# Altium schematic sheet power.SchDoc
size A4
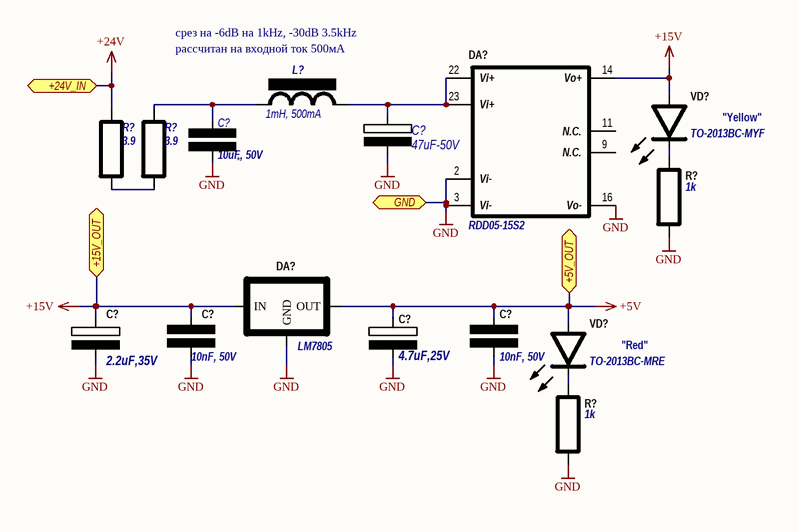
[diagram p0: power.SchDoc]

## Parts
(Parts that share a designator on the sheet are numbered #1, #2 ... from top to bottom, then left to right.)
C?#1  47uF-50V  [Cap_El_6.3x11x2.5_horizontal]
C?#2  10uF, 50V  [C1210]
C?#3  2.2uF,35V  [C2412_CaseC_Tant]
C?#4  4.7uF,25V  [C1411_CaseB_Tant]
C?#5  10nF, 50V  [C0603]
C?#6  10nF, 50V  [C0603]
DA?#1  RDD05-15S2  [FDD03-05S4]
DA?#2  LM7805  [D2PAK_LM7805_D2PAK(Primary)]
L?  1mH, 500mA  [L_SMD 1212]
R?#1  3.9  [R2512]
R?#2  3.9  [R2512]
R?#3  1k  [R0805]
R?#4  1k  [R0805]
VD?#1  value TO-2013BC-MYF  [led0805]  (hidden comment: LED_0805)
VD?#2  value TO-2013BC-MRE  [led0805]  (hidden comment: LED_0805)

## Ports
+5V_OUT, +15V_OUT, +24V_IN, GND

## Nets
+5V: C?#4.1(P) C?#6.2 DA?#2.3(OUT) VD?#2.2(A) ; port +5V_OUT
+15V: C?#3.1(P) C?#5.2 DA?#1.14(Vo+) DA?#2.1(IN) VD?#1.2(A) ; port +15V_OUT
+24V: R?#1.2 ; port +24V_IN
GND: C?#1.2 C?#2.1 C?#3.2(M) C?#4.2(M) C?#5.1 C?#6.1 DA?#1.2(Vi-) DA?#1.3(Vi-) DA?#1.16(Vo-) DA?#2.2(GND) R?#3.1 R?#4.1 ; port GND
NetC?#1_1: C?#1.1 DA?#1.22(Vi+) DA?#1.23(Vi+) L?.1
NetC?#2_2: C?#2.2 L?.2 R?#2.2
NetR?#1_1: R?#1.1 R?#2.1
NetR?#3_2: R?#3.2 VD?#1.1(K)
NetR?#4_2: R?#4.2 VD?#2.1(K)

Not connected (* = marked no-connect by the designer): DA?#1 9(N.C.) 11(N.C.)

## Notes on the sheet
- срез на -6dB на 1kHz, -30dB 3.5kHz
- рассчитан на входной ток 500мА
- (near VD?#1) "Yellow"
- (near VD?#2) "Red"

## Library data of the parts
C?#1 = Capacitor Polar: =Value; fab: *; Value: 47uF-50V
C?#2 C?#5 C?#6 = Capacitor: fab: *
  C?#2: Value: 10uF, 50V
  C?#5 C?#6: Value: 10nF, 50V
C?#3 C?#4 = Capacitor Tantalum: =Value; DEV: CPS_3216_01; FAB: AVX; TEMP: -55°C а 125°C; BOI: A; DESIG: LOW ESR TANTALUM CAPACITOR; TOL: 10%; REF: TPSA106K010R1800
  C?#3: Value: 2.2uF,35V
  C?#4: Value: 4.7uF,25V
DA?#1 = RDD05-15S2: DC - DC CONVERTER  5 ~ 6W SINGLE OUTPUT; man: RDD05-15S2
DA?#2 = LM7805_D2PAK: Value: L7805ABD2T-TR
L? = L_REACTOR: L_AVCC; fab: *; value: 1mH, 500mA
R?#1 R?#2 = R: SMD resistor; Value: 3.9
R?#3 R?#4 = Resistor_russian: Resistor; Value: 1k